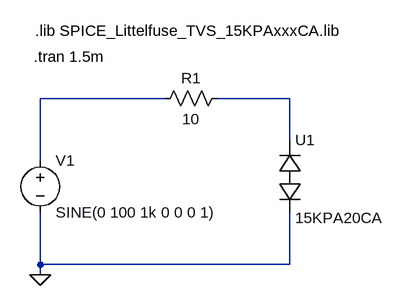
[diagram p0: schematic tvs_test1.asc]
tvs_test1.asc, the LTspice schematic file:
Version 4
SHEET 1 880 680
WIRE 208 32 16 32
WIRE 400 32 288 32
WIRE 400 96 400 32
WIRE 16 128 16 32
WIRE 16 288 16 208
WIRE 400 288 400 208
WIRE 400 288 16 288
WIRE 16 304 16 288
FLAG 16 304 0
SYMBOL voltage 16 112 R0
WINDOW 123 0 0 Left 0
WINDOW 39 0 0 Left 0
SYMATTR InstName V1
SYMATTR Value SINE(0 100 1k 0 0 0 1)
SYMBOL res 192 48 R270
WINDOW 0 32 56 VTop 0
WINDOW 3 0 56 VBottom 0
SYMATTR InstName R1
SYMATTR Value 10
SYMBOL tvs_bipolar_diode 384 144 R0
SYMATTR InstName U1
SYMATTR Value 15KPA20CA
TEXT 8 -72 Left 0 !.lib SPICE_Littelfuse_TVS_15KPAxxxCA.lib
TEXT 6 -32 Left 0 !.tran 1.5m

The netlist it stands for:
* tvs_test1.asc
V1 N001 0 SINE(0 100 1k 0 0 0 1)
R1 N001 N002 10
XU1 N002 0 15KPA20CA  ; pins + -
.lib SPICE_Littelfuse_TVS_15KPAxxxCA.lib
.tran 1.5m
.backanno
.end